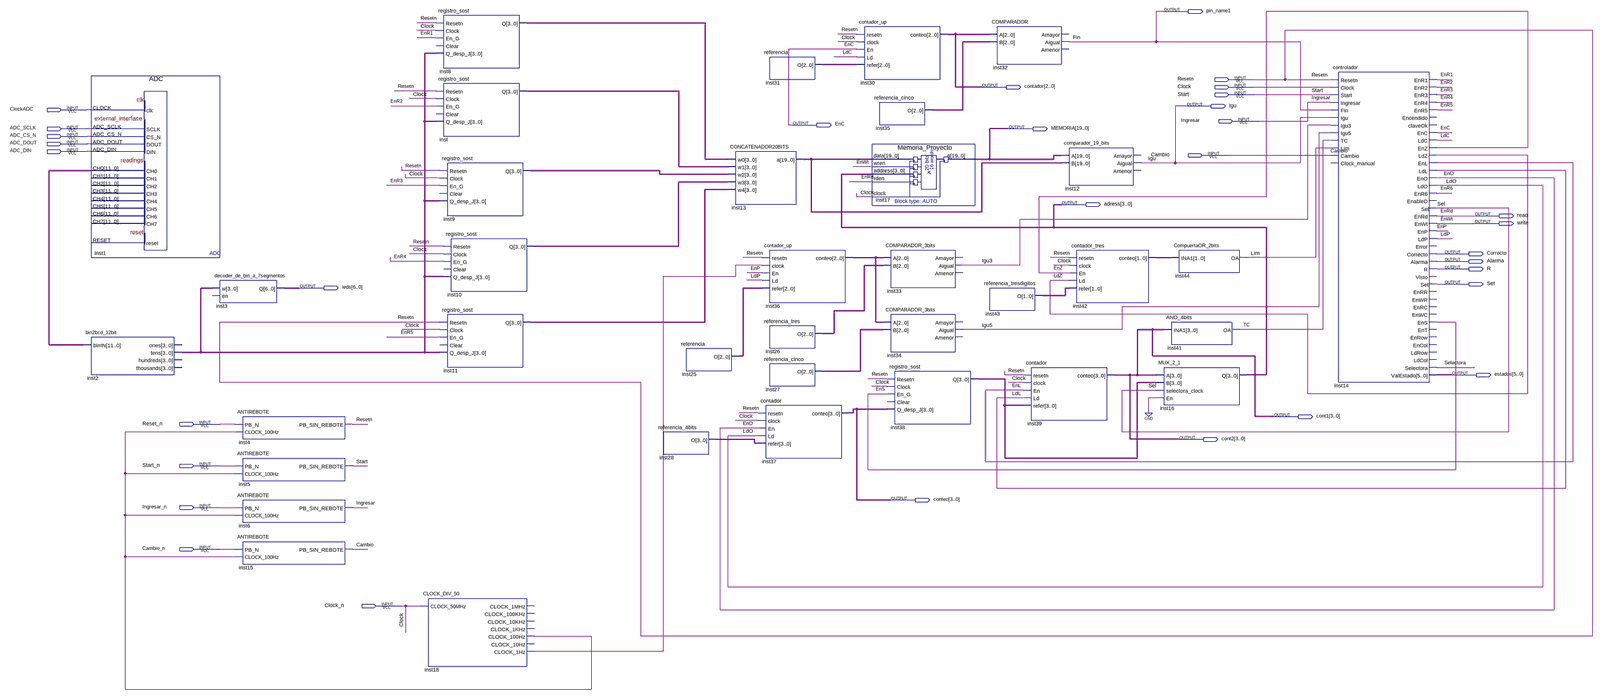
[diagram p0: schematic sheet, whole]
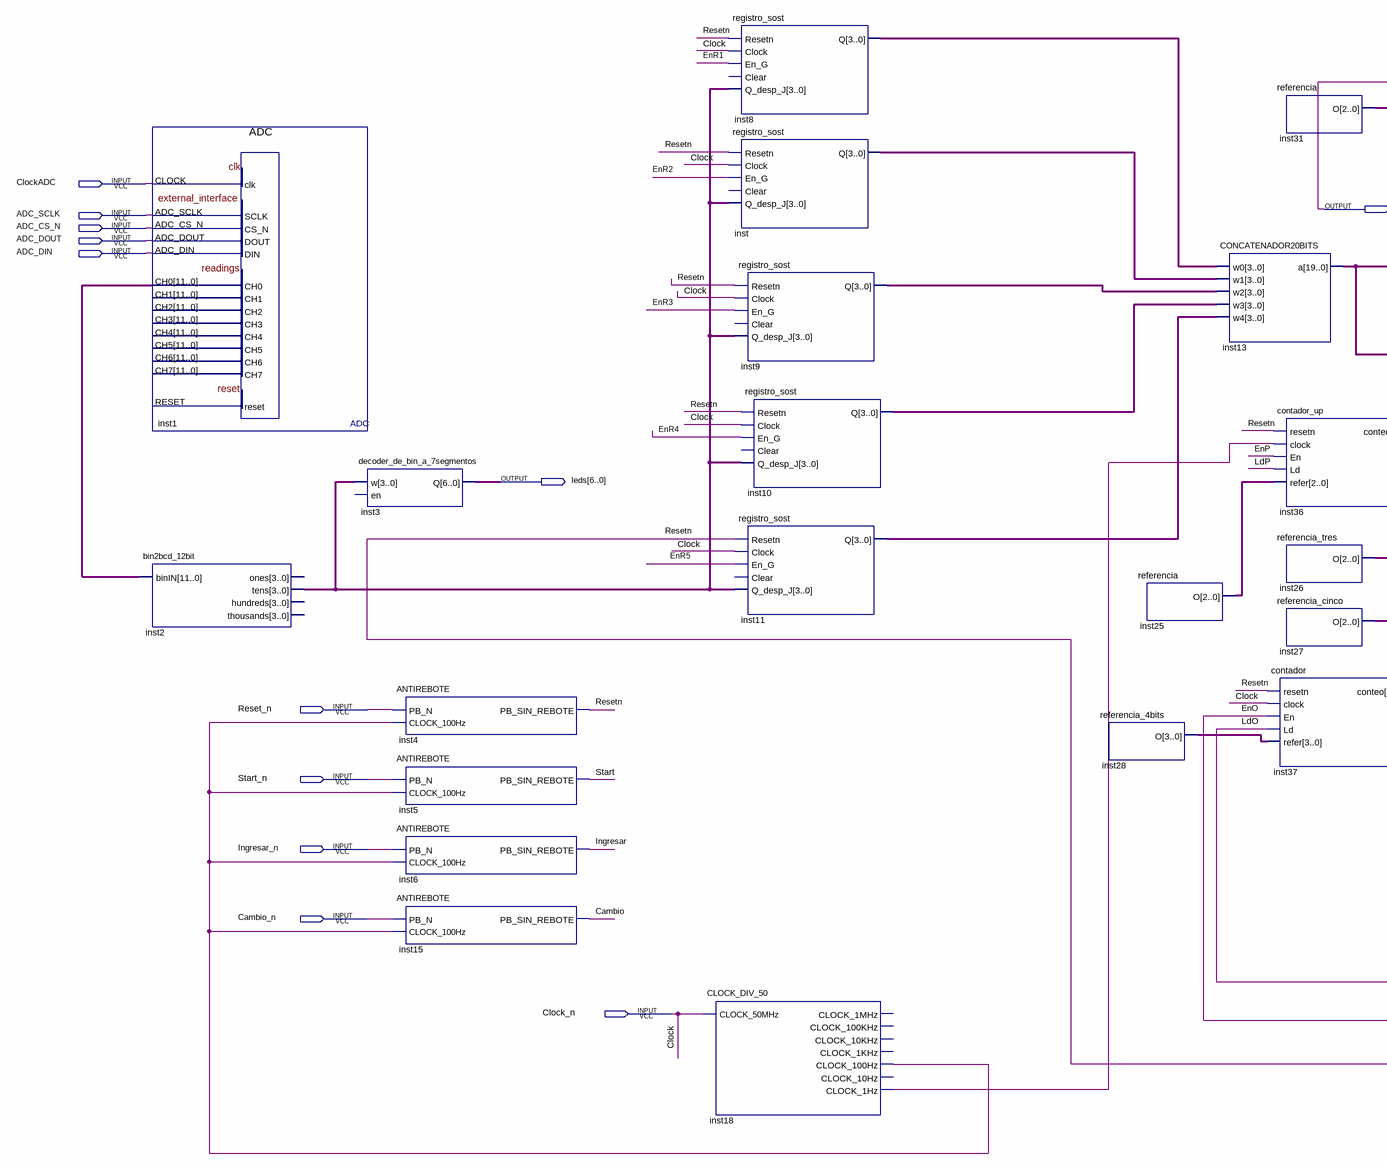
[diagram p1: schematic sheet, left part]
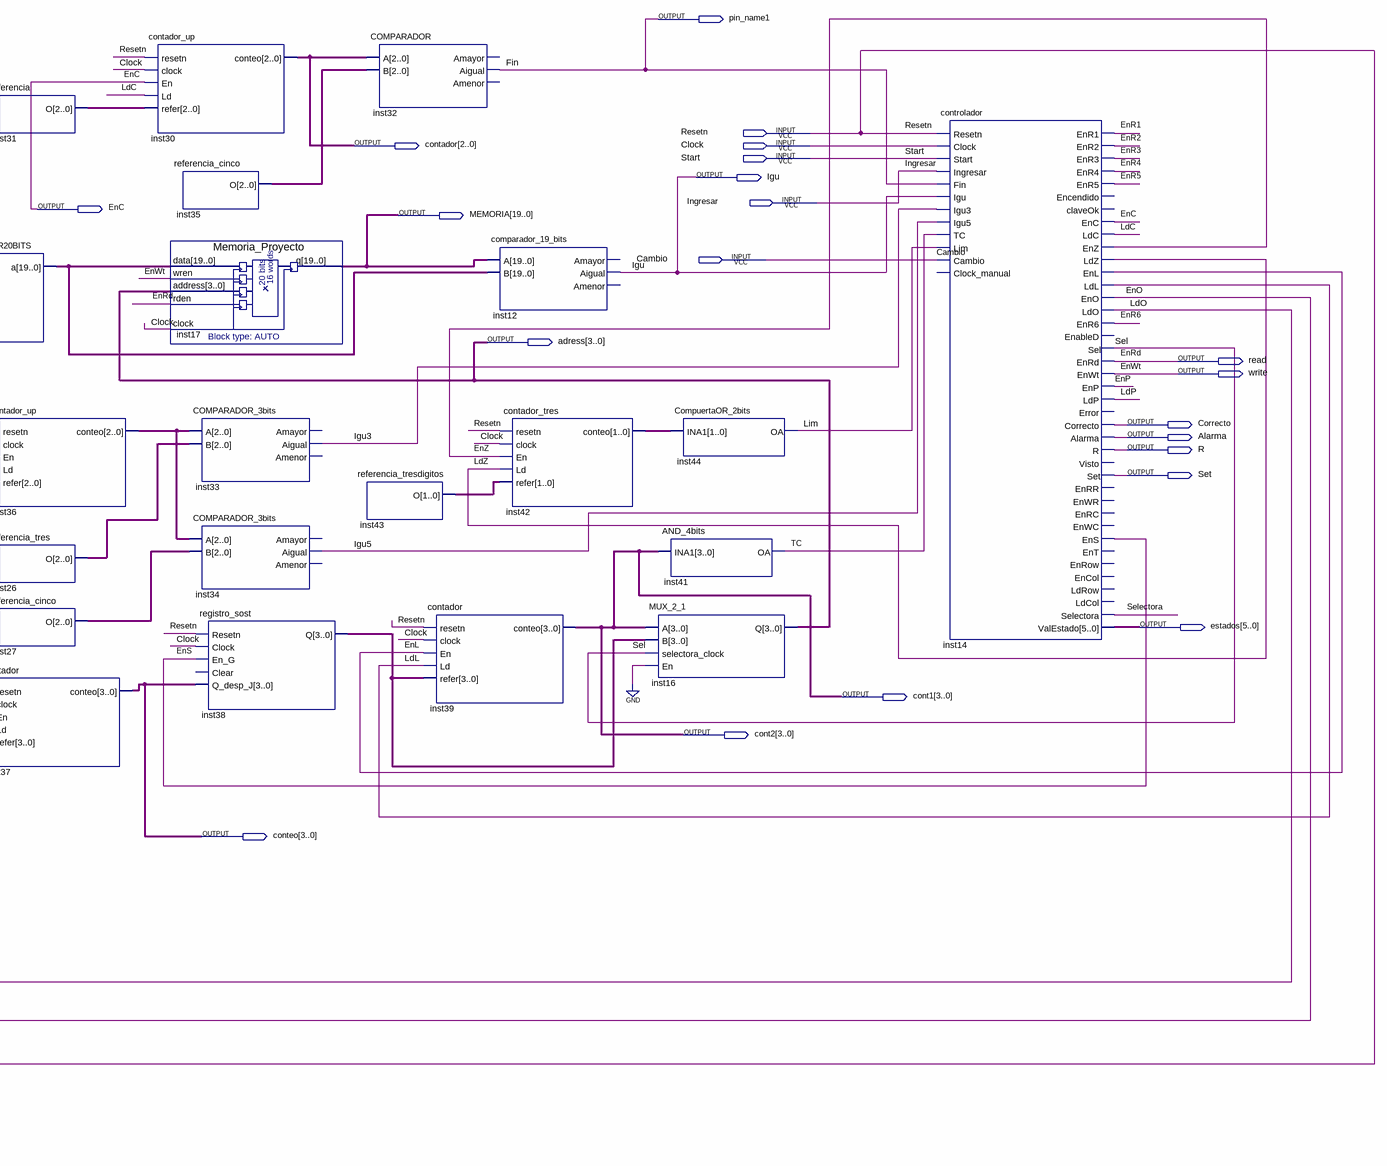
[diagram p2: schematic sheet, right part]
// Quartus schematic PROYECTO_SD2_SIMULAR.bdf as structural Verilog: 36 symbols, 32 pins
module PROYECTO_SD2_SIMULAR (
  input  Resetn,
  input  Clock,
  input  Start,
  input  ClockADC,
  input  Ingresar,
  input  ADC_SCLK,
  input  ADC_CS_N,
  input  ADC_DOUT,
  input  ADC_DIN,
  input  Cambio,
  input  Reset_n,
  input  Start_n,
  input  Ingresar_n,
  input  Cambio_n,
  input  Clock_n,
  output pin_name1,
  output [2:0] contador,
  output Igu,
  output EnC,
  output [19:0] MEMORIA,
  output [3:0] adress,
  output read,
  output write,
  output Correcto,
  output Alarma,
  output R,
  output Set,
  output [6:0] leds,
  output [5:0] estados,
  output [3:0] cont1,
  output [3:0] cont2,
  output [3:0] conteo
);

  wire EnL, EnO, EnP, EnR1, EnR2, EnR3, EnR4, EnR5, EnR6, EnS, EnZ, Igu3, Igu5, inst18_clock_1hz,
       inst18_clock_100hz, LdC, LdL, LdO, LdP, LdZ, Lim, Sel, Selectora, TC;
  wire [1:0] inst42_conteo, inst43_o;
  wire [2:0] inst25_o, inst26_o, inst27_o, inst31_o, inst35_o, inst36_conteo;
  wire [3:0] inst2_tens, inst8_q, inst9_q, inst10_q, inst11_q, inst28_o, inst38_q, inst_q;
  wire [11:0] inst1_ch0;
  wire [19:0] inst13_a;

  bin2bcd_12bit inst2 (.binIN(inst1_ch0), .tens(inst2_tens));  // open: ones, hundreds, thousands
  ADC inst1 (
    .CLOCK(ClockADC), .ADC_DOUT(ADC_DOUT), .ADC_SCLK(ADC_SCLK), .ADC_CS_N(ADC_CS_N), .ADC_DIN(ADC_DIN),
    .CH0(inst1_ch0));  // open: RESET, CH1, CH2, CH3, CH4, CH5, CH6, CH7
  decoder_de_bin_a_7segmentos inst3 (.w(inst2_tens), .Q(leds));  // open: en
  ANTIREBOTE inst4 (.PB_N(Reset_n), .CLOCK_100Hz(inst18_clock_100hz), .PB_SIN_REBOTE(Resetn));
  ANTIREBOTE inst5 (.PB_N(Start_n), .CLOCK_100Hz(inst18_clock_100hz), .PB_SIN_REBOTE(Start));
  ANTIREBOTE inst6 (.PB_N(Ingresar_n), .CLOCK_100Hz(inst18_clock_100hz), .PB_SIN_REBOTE(Ingresar));
  ANTIREBOTE inst15 (.PB_N(Cambio_n), .CLOCK_100Hz(inst18_clock_100hz), .PB_SIN_REBOTE(Cambio));
  registro_sost inst8 (.Resetn(Resetn), .Clock(Clock), .En_G(EnR1), .Q_desp_J(inst2_tens), .Q(inst8_q));  // open: Clear
  registro_sost inst (.Resetn(Resetn), .Clock(Clock), .En_G(EnR2), .Q_desp_J(inst2_tens), .Q(inst_q));  // open: Clear
  registro_sost inst9 (.Resetn(Resetn), .Clock(Clock), .En_G(EnR3), .Q_desp_J(inst2_tens), .Q(inst9_q));  // open: Clear
  registro_sost inst10 (
    .Resetn(Resetn), .Clock(Clock), .En_G(EnR4), .Q_desp_J(inst2_tens), .Q(inst10_q));  // open: Clear
  registro_sost inst11 (
    .Resetn(Resetn), .Clock(Clock), .En_G(EnR5), .Q_desp_J(inst2_tens), .Q(inst11_q));  // open: Clear
  CLOCK_DIV_50 inst18 (
    .CLOCK_50MHz(Clock), .CLOCK_100Hz(inst18_clock_100hz), .CLOCK_1Hz(inst18_clock_1hz));  // open: CLOCK_1MHz, CLOCK_100KHz, CLOCK_10KHz, CLOCK_1KHz, CLOCK_10Hz
  referencia_4bits inst28 (.O(inst28_o));
  referencia inst25 (.O(inst25_o));
  CONCATENADOR20BITS inst13 (.w0(inst8_q), .w1(inst_q), .w2(inst9_q), .w3(inst10_q), .w4(inst11_q), .a(inst13_a));
  referencia inst31 (.O(inst31_o));
  contador_up inst36 (
    .resetn(Resetn), .clock(inst18_clock_1hz), .En(EnP), .Ld(LdP), .refer(inst25_o), .conteo(inst36_conteo));
  referencia_tres inst26 (.O(inst26_o));
  referencia_cinco inst27 (.O(inst27_o));
  contador inst37 (.resetn(Resetn), .clock(Clock), .En(EnO), .Ld(LdO), .refer(inst28_o), .conteo(conteo));
  contador_up inst30 (.resetn(Resetn), .clock(Clock), .En(EnC), .Ld(LdC), .refer(inst31_o), .conteo(contador));
  referencia_cinco inst35 (.O(inst35_o));
  Memoria_Proyecto inst17 (.data(inst13_a), .wren(write), .address(adress), .rden(read), .clock(Clock), .q(MEMORIA));
  COMPARADOR_3bits inst33 (.A(inst36_conteo), .B(inst26_o), .Aigual(Igu3));  // open: Amayor, Amenor
  COMPARADOR_3bits inst34 (.A(inst36_conteo), .B(inst27_o), .Aigual(Igu5));  // open: Amayor, Amenor
  registro_sost inst38 (.Resetn(Resetn), .Clock(Clock), .En_G(EnS), .Q_desp_J(conteo), .Q(inst38_q));  // open: Clear
  COMPARADOR inst32 (.A(contador), .B(inst35_o), .Aigual(pin_name1));  // open: Amayor, Amenor
  referencia_tresdigitos inst43 (.O(inst43_o));
  contador inst39 (.resetn(Resetn), .clock(Clock), .En(EnL), .Ld(LdL), .refer(inst38_q), .conteo(cont1));
  comparador_19_bits inst12 (.A(MEMORIA), .B(inst13_a), .Aigual(Igu));  // open: Amayor, Amenor
  contador_tres inst42 (.resetn(Resetn), .clock(Clock), .En(EnZ), .Ld(LdZ), .refer(inst43_o), .conteo(inst42_conteo));
  CompuertaOR_2bits inst44 (.INA1(inst42_conteo), .OA(Lim));
  AND_4bits inst41 (.INA1(cont1), .OA(TC));
  MUX_2_1 inst16 (.A(cont1), .B(inst38_q), .selectora_clock(Sel), .En(1'b0), .Q(adress));
  controlador inst14 (
    .Resetn(Resetn), .Clock(Clock), .Start(Start), .Ingresar(Ingresar), .Fin(pin_name1), .Igu(Igu),
    .Igu3(Igu3), .Igu5(Igu5), .TC(TC), .Lim(Lim), .Cambio(Cambio), .EnR1(EnR1), .EnR2(EnR2), .EnR3(EnR3),
    .EnR4(EnR4), .EnR5(EnR5), .EnC(EnC), .LdC(LdC), .EnZ(EnZ), .LdZ(LdZ), .EnL(EnL), .LdL(LdL), .EnO(EnO),
    .LdO(LdO), .EnR6(EnR6), .Sel(Sel), .EnRd(read), .EnWt(write), .EnP(EnP), .LdP(LdP), .Correcto(Correcto),
    .Alarma(Alarma), .R(R), .Set(Set), .EnS(EnS), .Selectora(Selectora), .ValEstado(estados));  // open: Clock_manual, Encendido, claveOk, EnableD, Error, Visto, EnRR, EnWR, EnRC, EnWC, EnT, EnRow, EnCol, LdRow, LdCol

  assign Clock_n = Clock;
  assign cont2 = cont1;

  // Other names for the same wires on the sheet: EnRd = read; EnWt = write; Fin = pin_name1
endmodule
